# Altium schematic sheet SCH_PWR.SchDoc: TP Final - Reloj - PWR
size A4; Author: Luciano Lopez; CompanyName: UTN - FRBA; Revision: 1; SheetNumber: 10; SheetTotal: 10
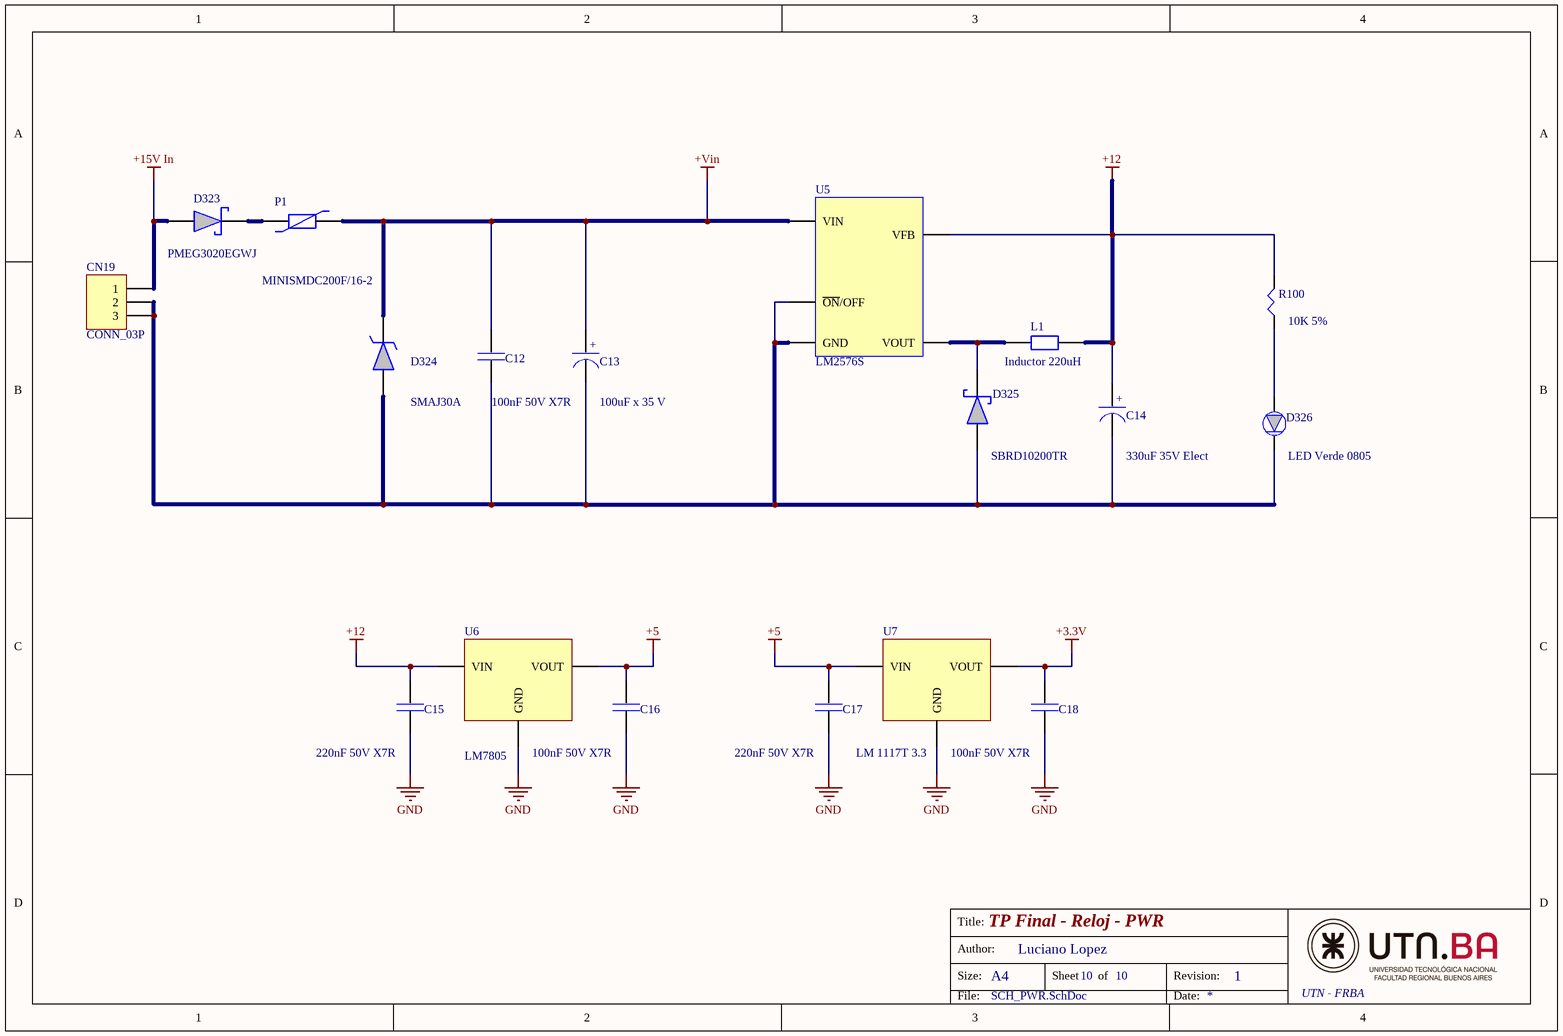
[diagram p0: SCH_PWR.SchDoc]

## Parts
C12  100nF 50V X7R  [C_0805]
C13  100uF x 35 V  [C_220ufx35V]
C14  330uF 35V Elect  [C_220ufx35V]
C15  220nF 50V X7R  [C_0805]
C16  100nF 50V X7R  [C_0805]
C17  220nF 50V X7R  [C_0805]
C18  100nF 50V X7R  [C_0805]
CN19  CONN_03P  [JACK_2.5mm_F]
D323  PMEG3020EGWJ
D324  SMAJ30A
D325  SBRD10200TR
D326  LED Verde 0805  [LED_0805]
L1  Inductor 220uH
P1  MINISMDC200F/16-2
R100  10K 5%  [R_0805]
U5  LM2576S
U6  LM7805
U7  LM 1117T 3.3

## Nets
+3.3V: C18.1 U7.3(VOUT)
+5: C16.1 C17.1 U6.3(VOUT) U7.1(VIN)
+12: C14.1 C15.1 L1.2 R100.2 U5.4(VFB) U6.1(VIN)
+15V In: CN19.1 D323.1
+Vin: C12.1 C13.1 D324.2 P1.2 U5.1(VIN)
GND: C15.2 C16.2 C17.2 C18.2 U6.2(GND) U7.2(GND)
NetC12_2: C12.2 C13.2 C14.2 CN19.2 CN19.3 D324.1 D325.1 D326.2 U5.3(GND) U5.5(~{ON}/OFF)
NetD323_2: D323.2 P1.1
NetD325_2: D325.2 L1.1 U5.2(VOUT)
NetD326_1: D326.1 R100.1

## Notes on the sheet
- Title:
- Size:
- Author:
- A4
- Sheet
- of
- Revision:
- File:
- Date:
- (in symbol POL_CAP) +

## Library data of the parts
C12 C15-C18 = Capacitor: Capacitor ceramico 100nF x 50v
C13 = POL_CAP: Capacitor Polarizado EEE-FK1V101P
C14 = POL_CAP: Capacitor polarizado EMVY250ADA331MHA0G
CN19 = CONN_03P: Connector Generic 3 Vias
D323 = SCHOTTKY_DIODE: Diodo Schottky
D324 = TVS_DIODE: Diodo supresor
D325 = SCHOTTKY_DIODE: Diodo Schottky SBRD10200TR
D326 = LED_DIODE: LED rojo 0805
L1 = Inductor: 732-11717-ND
P1 = Polyswitch
R100 = Resistor
U5 = Integrado-LM2576S: Driver Switching
U6 U7 = Linear_Regulator: Regulador Lineal